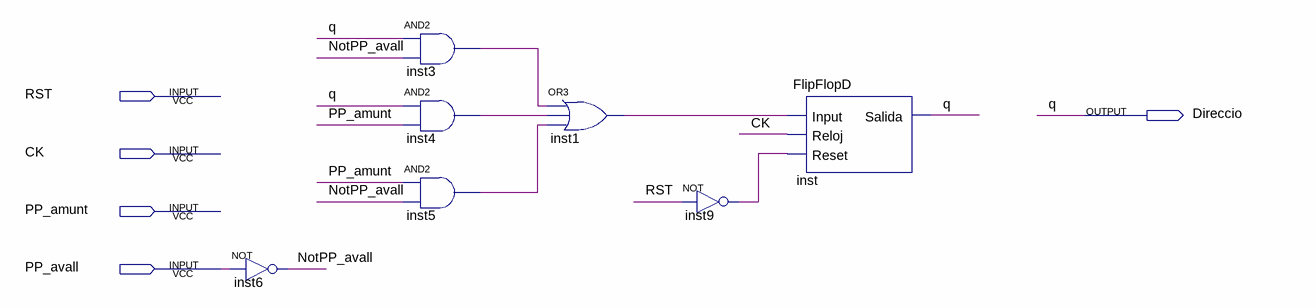
[diagram p0: schematic sheet]
// Quartus schematic UC_DIR.bdf as structural Verilog: 7 symbols, 5 pins
module UC_DIR (
  input  RST,
  input  CK,
  input  PP_amunt,
  input  PP_avall,
  output Direccio
);

  wire inst1_out, inst3_out, inst4_out, inst5_out, inst9_out, NotPP_avall;

  not inst6 (NotPP_avall, PP_avall);
  and inst3 (inst3_out, Direccio, NotPP_avall);
  and inst4 (inst4_out, Direccio, PP_amunt);
  and inst5 (inst5_out, PP_amunt, NotPP_avall);
  or inst1 (inst1_out, inst3_out, inst4_out, inst5_out);
  not inst9 (inst9_out, RST);
  FlipFlopD inst (.Input(inst1_out), .Reloj(CK), .Reset(inst9_out), .Salida(Direccio));

  // Other names for the same wires on the sheet: q = Direccio
endmodule
